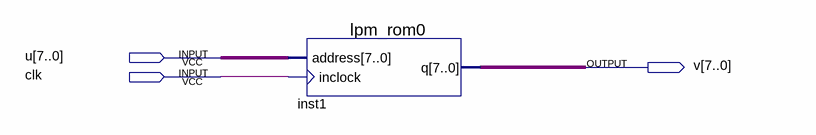
[diagram p0: schematic sheet]
// Quartus schematic H_func.bdf as structural Verilog: 1 symbols, 3 pins
module H_func (
  input  [7:0] u,
  input  clk,
  output [7:0] v
);

  lpm_rom0 inst1 (.address(u), .inclock(clk), .q(v));
endmodule
